# Altium schematic sheet KLDX-0202-B_2022-10-06.schdoc
size 40 x 29 mm
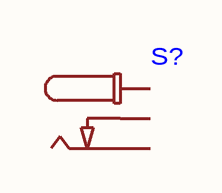
[diagram p0: KLDX-0202-B_2022-10-06.schdoc]

## Parts
S?  (no value)  [KLDX-0202-B]

## Nets

Not connected (* = marked no-connect by the designer): S? P1 P2 P3

## Library data of the parts
S? = KLDX-0202-B